# Altium schematic sheet EPS_Connectors.SchDoc
size A4; SheetNumber: 4; SheetTotal: 4
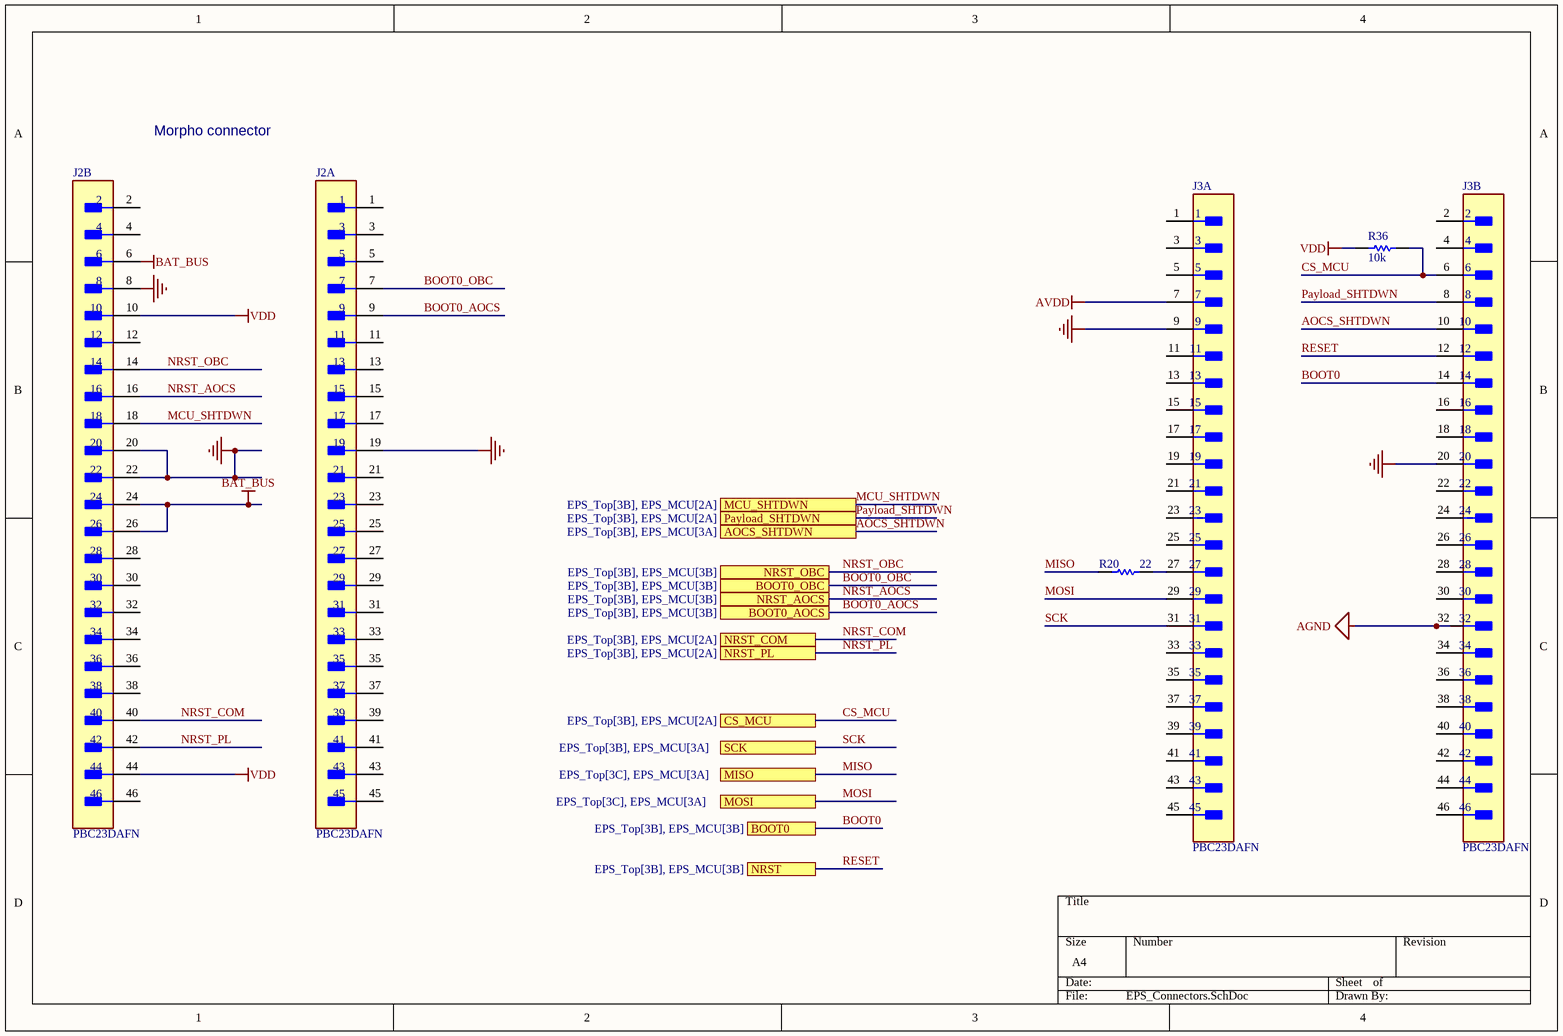
[diagram p0: EPS_Connectors.SchDoc]

## Parts
J2  PBC23DAFN  [FP-PBC23DAFN-MFG]  (parts A,B of 2)
J3  PBC23DAFN  [FP-PBC23DAFN-MFG]  (parts A,B of 2)
R20  22  [RESC1608X55X25NL10T15]
R36  10k  [RESC1005X40X25LL05T05]

## Ports
AOCS_SHTDWN (see EPS_Top[3B], EPS_MCU[3A]), BOOT0 (see EPS_Top[3B], EPS_MCU[3B]), BOOT0_AOCS (see EPS_Top[3B], EPS_MCU[3B]), BOOT0_OBC (see EPS_Top[3B], EPS_MCU[3B]), CS_MCU (see EPS_Top[3B], EPS_MCU[2A]), MCU_SHTDWN (see EPS_Top[3B], EPS_MCU[2A]), MISO (see EPS_Top[3C], EPS_MCU[3A]), MOSI (see EPS_Top[3C], EPS_MCU[3A]), NRST (see EPS_Top[3B], EPS_MCU[3B]), NRST_AOCS (see EPS_Top[3B], EPS_MCU[3B]), NRST_COM (see EPS_Top[3B], EPS_MCU[2A]), NRST_OBC (see EPS_Top[3B], EPS_MCU[3B]), NRST_PL (see EPS_Top[3B], EPS_MCU[2A]), Payload_SHTDWN (see EPS_Top[3B], EPS_MCU[2A]), SCK (see EPS_Top[3B], EPS_MCU[3A])

## Nets
AGND: J3.32
AVDD: J3.7
BAT_BUS: J2.6 J2.24 J2.26
GND: J2.8 J2.19 J2.20 J2.22 J3.9 J3.20
VDD: J2.10 J2.44 R36.2
AOCS_SHTDWN: J3.10 ; port AOCS_SHTDWN
BOOT0: J3.14 ; port BOOT0
BOOT0_AOCS: J2.9 ; port BOOT0_AOCS
BOOT0_OBC: J2.7 ; port BOOT0_OBC
CS_MCU: J3.6 R36.1 ; port CS_MCU
MCU_SHTDWN: J2.18 ; port MCU_SHTDWN
MISO: R20.1 ; port MISO
MOSI: J3.29 ; port MOSI
NRST_AOCS: J2.16 ; port NRST_AOCS
NRST_COM: J2.40 ; port NRST_COM
NRST_OBC: J2.14 ; port NRST_OBC
NRST_PL: J2.42 ; port NRST_PL
Payload_SHTDWN: J3.8 ; port Payload_SHTDWN
RESET: J3.12 ; port NRST
SCK: J3.31 ; port SCK
NetJ3_27: J3.27 R20.2

Not connected (* = marked no-connect by the designer): J2 1 2 3 4 5 11 12 13 15 17 21 23 25 27 28 29 30 31 32 33 34 35 36 37 38 39 41 43 45 46; J3 1 2 3 4 5 11 13 15 16 17 18 19 21 22 23 24 25 26 28 30 33 34 35 36 37 38 39 40 41 42 43 44 45 46

## Notes on the sheet
- Morpho connector

## Library data of the parts
J2 J3 = CMP-25680-000057-1: CONN HEADER VERT 46POS 2.54MM; Connector Type: Male Pin; Gender: Male; Number of Contacts: 46; Pitch: 0.1inch; Mount: Through Hole; Height: 2.54mm; Housing Material: Plastic; Contact Plating: Gold; Length: 58.4mm; RoHS Compliant: Yes; Packaging: Bulk; Termination: Solder; Number of Rows: 2; Series: -; Lead Free: Lead Free; Row Spacing: 0.1inch; Contact Type: Male Pin; Contact Material: Bronze; Color: Black; Number of Positions: 46; Width: 5.08mm; Contact Mating Length: 0.23inch; Package Quantity: 1; Housing Color: Black
R20 = CMP-1659-00033-1: Chip Resistor, 22 Ohm, +/- 1%, 0.1 W, -55 to 155 degC, 0603 (1608 Metric), RoHS, Tape and Reel; Max Ouput Current: 8 A; Case\Package: SIP; Max Input Voltage: 1.4 V; ComponentLink2URL: http://www.yageo.com/documents/recent/PYu-RC_Group_51_RoHS_L_04.pdf; RoHSCompliant: true; Max Operating Temperature: 100 degC; PackageDescription: 2-Pin Surface Mount Device, Body 1.6 x 0.8 mm; ComponentLink1Description: Manufacturer URL; ComponentLink1URL: http://www.yageo.com/; Length: 18.5 mm; REACH SVHC: Unknown; Pins: 4; DatasheetVersion: Rev. 4, 02/2016; PackageReference: 0603; Output Current: 8 A; Min Operating Temperature: -25 degC; Height: 19.6 mm; Mount: Through Hole; Radiation Hardening: No; ComponentLink2Description: Datasheet; Package Quantity: 200; Packaging: Rail/Tube
R36 = CMP-2000-07588-1: Chip Resistor, 10 KOhm, +/- 1%, 0.1 W, -55 to 155 degC, 0402 (1005 Metric), RoHS, Tape and Reel; Manufacturer: Panasonic; Power Rating: 100mW; Voltage Rating: 50V; Resistance: 10KOhm; Case\/Package: 0402; Temperature Coefficient: 100ppm\/degreesC; RoHSCompliant: True; Lead Free: LeadFree; Package Quantity: 1; Contact Plating: Tin; Length: 1mm; Radiation Hardening: No; REACH SVHC: NoSVHC; Max Operating Temperature: 155degC; Depth: 0.5mm; Case Code (Imperial): 0402; Military Standard: Not; Package Description: 2-Pin Surface Mount Device, Body 1 x 0.5 mm; Termination: SMD/SMT; Case Code (Metric): 1005; Height: 0.35mm; Packaging: TapeandReel; Voltage Rating (DC): 50V; Package Reference: 402; Number of Pins: 2; Tolerance: 1%; Mounting Technology: SurfaceMount; Width: 0.02inch; Mount: SurfaceMount; Datasheet URL: https://industrial.panasonic.com/cdbs/www-data/pdf/RDA0000/AOA0000C304.pdf; Composition: ThickFilm; Datasheet Version: 02/2017; Manufacturer URL: http://www.panasonic.com/; Max Power Dissipation: 100mW; Number of Terminations: 2; Min Operating Temperature: -55degC